# Altium schematic sheet Принц. схема - чертеж (корпуса).SchDoc
size 594 x 420 mm; PageSetup: Record=PageOptions|CenterHorizontal=True|CenterVertical=True|PrintScale=1.00|XCorrection=1.00|YCorrection=1.00|PrintKind=0|BorderSize=5000000|LeftOffset=0|BottomOffset=0|Orientation=2|PaperLength=1000|PaperWidth=1000|Scale=100|PaperSource=15|PrintQuality=1200|MediaType=1|DitherType=10|PrintScaleMode=0|PaperKind=A2|PaperIndex=66
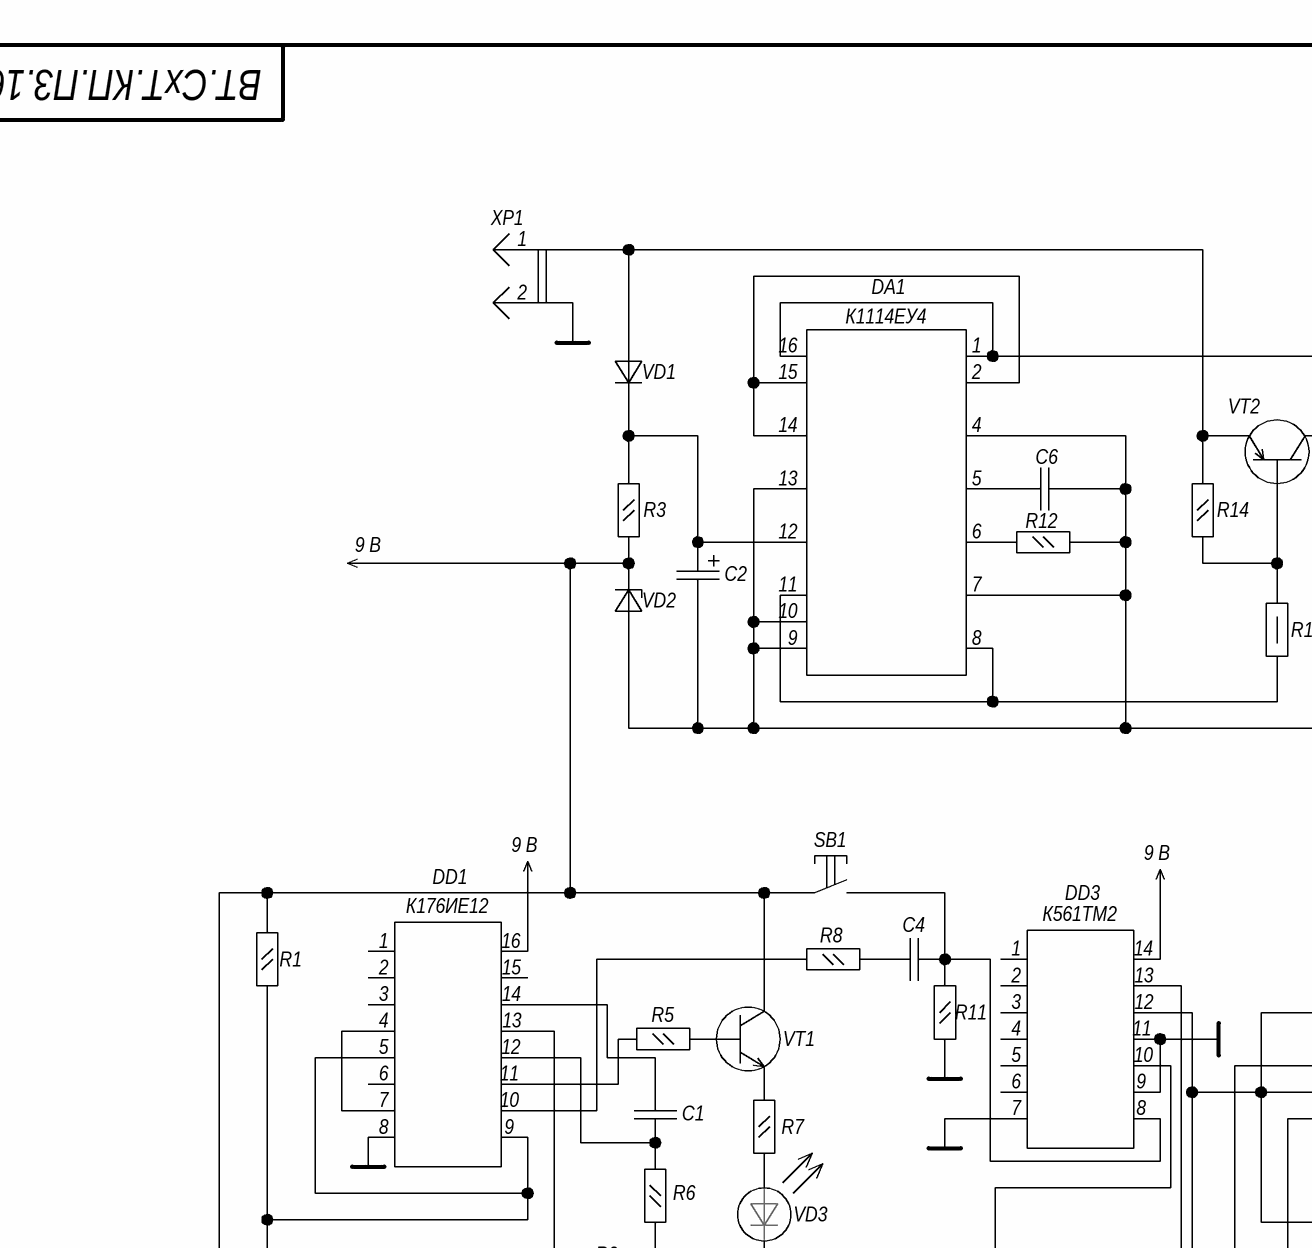
[diagram p0: Принц. схема - чертеж (корпуса).SchDoc, top left]
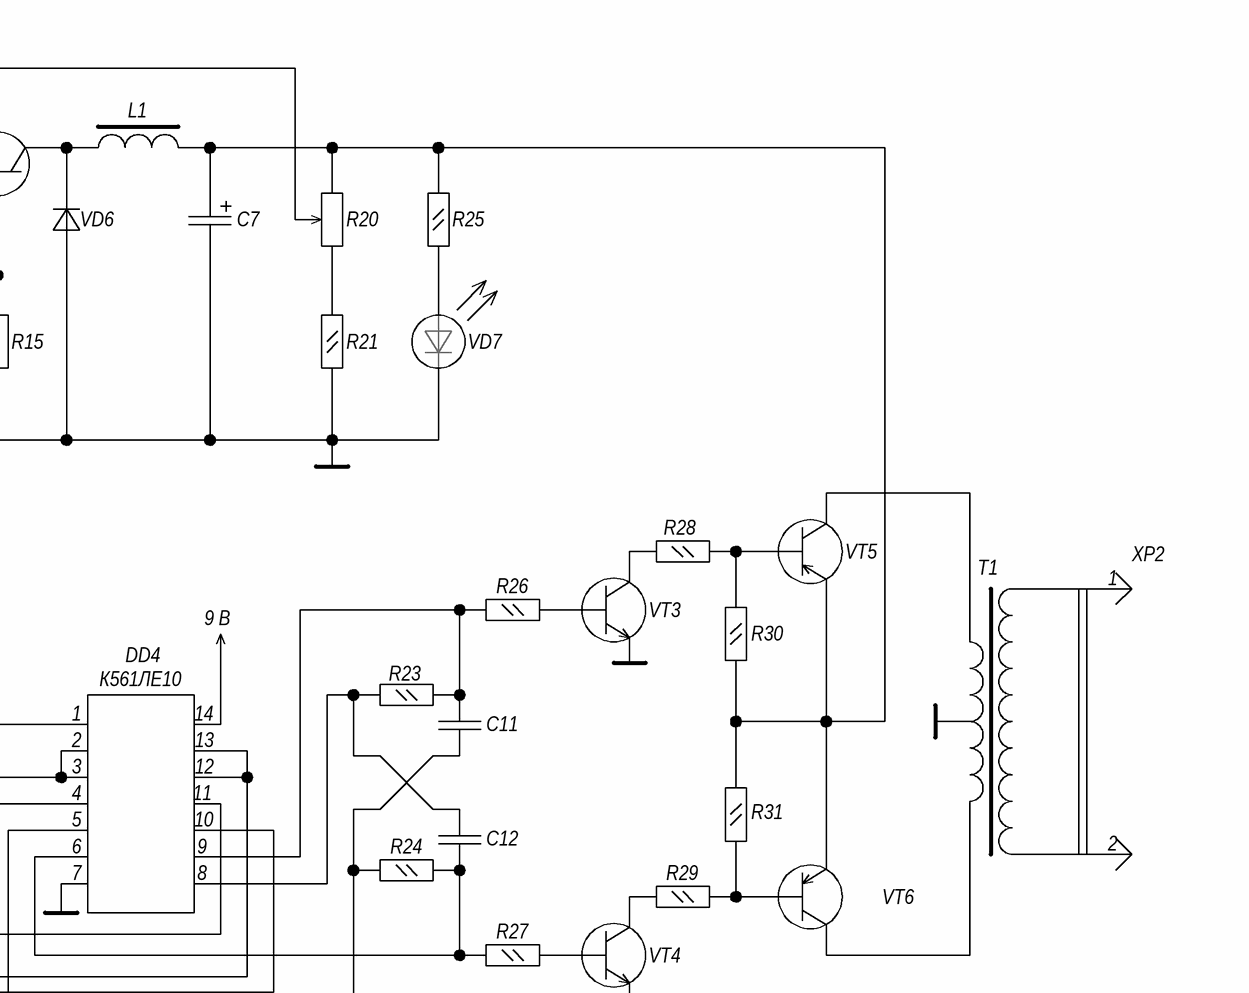
[diagram p1: Принц. схема - чертеж (корпуса).SchDoc, top right]
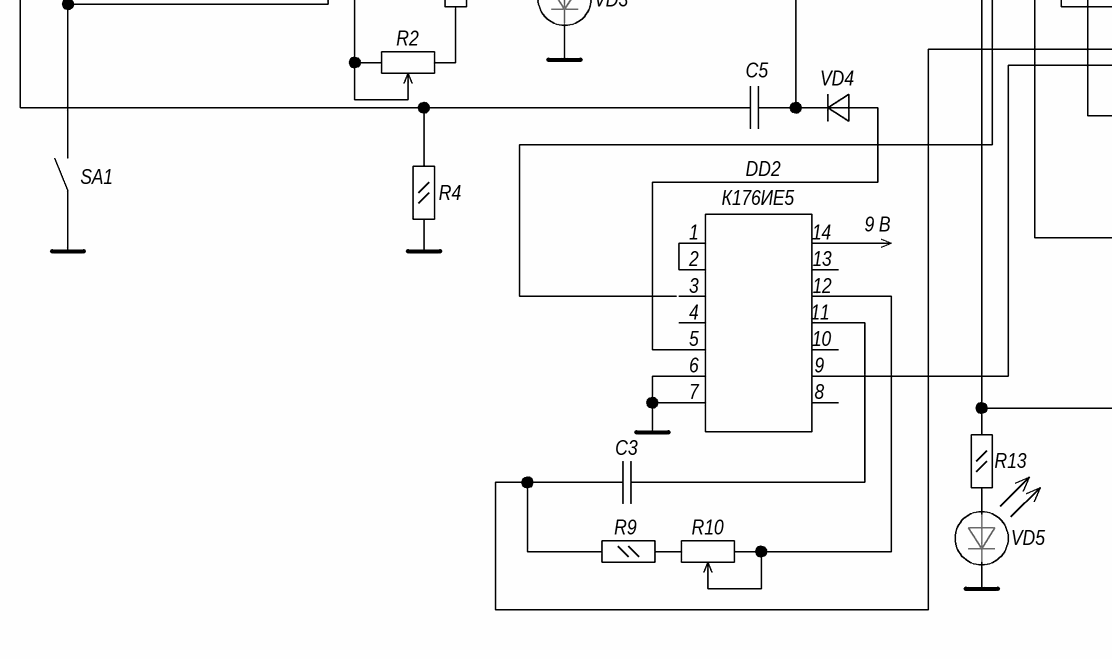
[diagram p2: Принц. схема - чертеж (корпуса).SchDoc, bottom left]
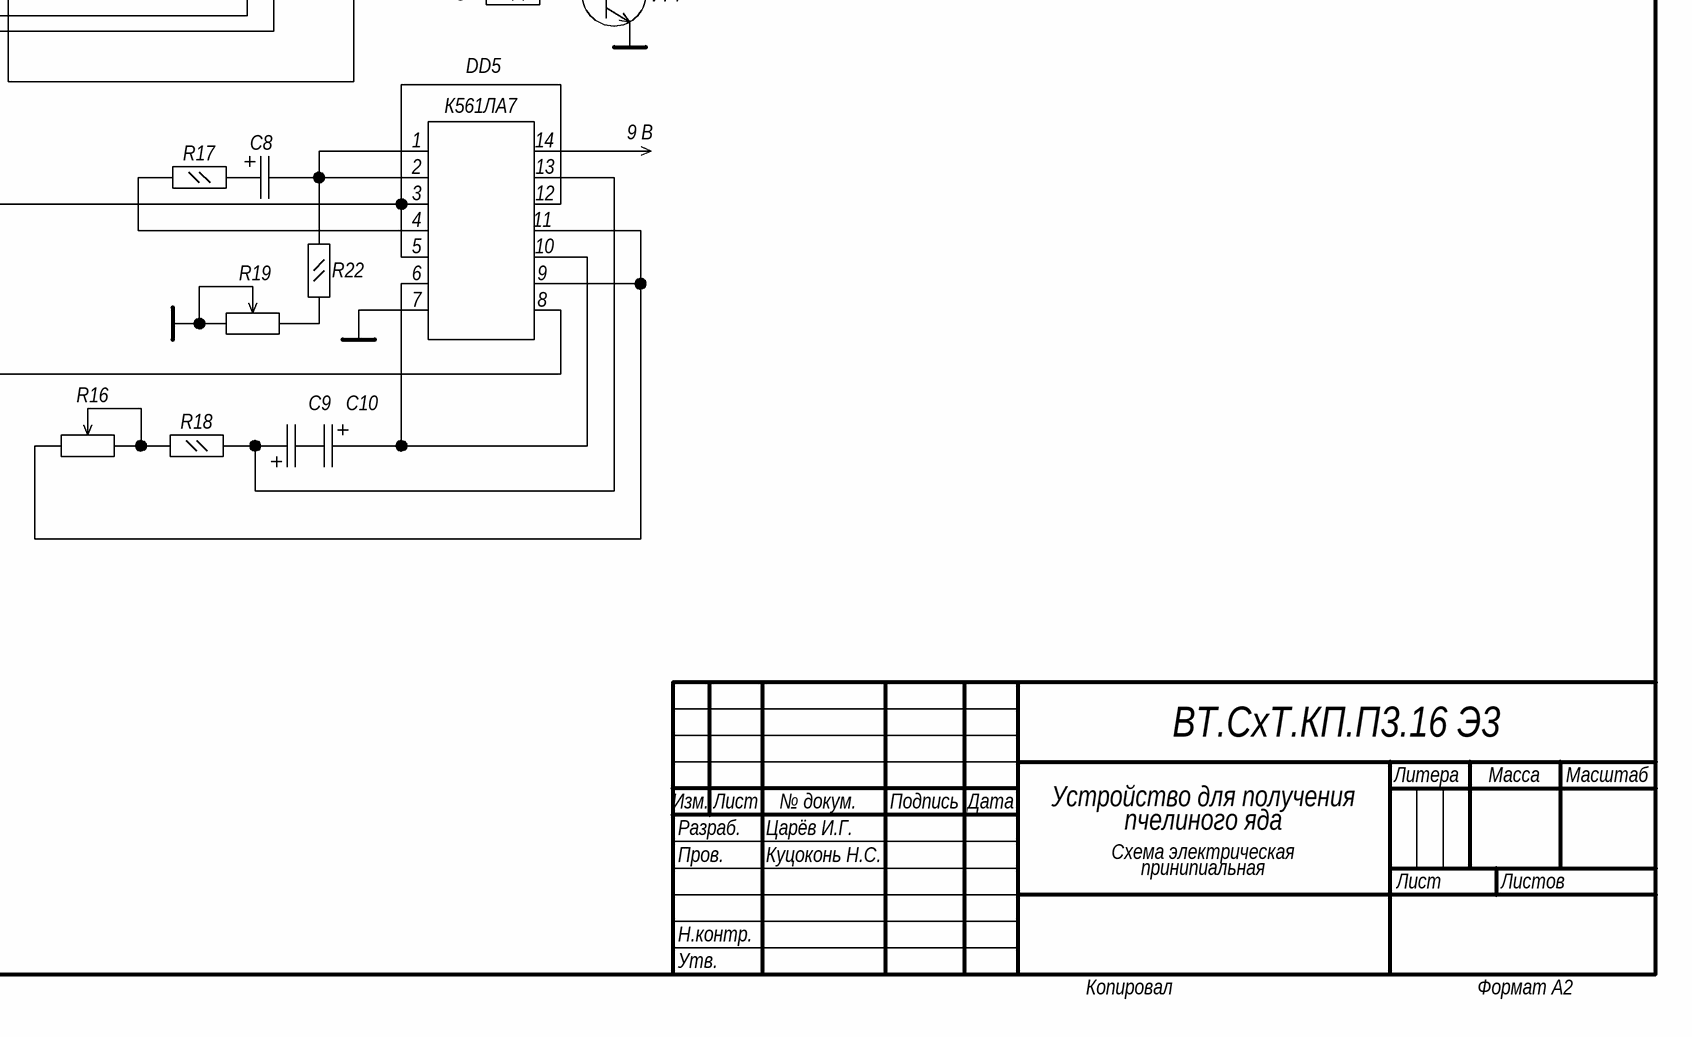
[diagram p3: Принц. схема - чертеж (корпуса).SchDoc, bottom right]

## Notes on the sheet
- ВТ.СхТ.КП.П3.16 Э3
- XP1
- 1
- 2
- К1114ЕУ4
- DA1
- VD1
- 16
- 15
- 14
- 4
- C6
- VT2
- L1
- R3
- 13
- 5
- R12
- R14
- VD6
- C7
- R20
- R25
- 9 В
- C2
- 12
- 11
- 7
- 6
- VD2
- 10
- 9
- 8
- R15
- R21
- VD7
- SB1
- R28
- VT5
- T1
- XP2
- К176ИЕ12
- DD1
- C4
- К561ТМ2
- DD3
- R26
- VT3
- R30
- R1
- 3
- R8
- К561ЛЕ10
- DD4
- R23
- R5
- VT1
- R11
- C11
- C1
- R7
- R24
- C12
- R31
- R6
- R29
- VT6
- R2
- VD3
- R27
- VT4
- C5
- VD4
- DD5
- SA1
- DD2
- R17
- C8
- К561ЛА7
- R4
- К176ИЕ5
- R19
- R22
- C3
- R13
- R16
- R18
- C9
- C10
- R9
- R10
- VD5
- Разраб.
- Изм.
- Лист
- Царёв И.Г.
- № докум.
- Подпись
- Дата
- Устройство для получения
- пчелиного яда
- Литера
- Масса
- Масштаб
- Пров.
- Куцоконь Н.С.
- Схема электрическая
- принипиальная
- Листов
- Н.контр.
- Утв.
- Копировал
- Формат А2